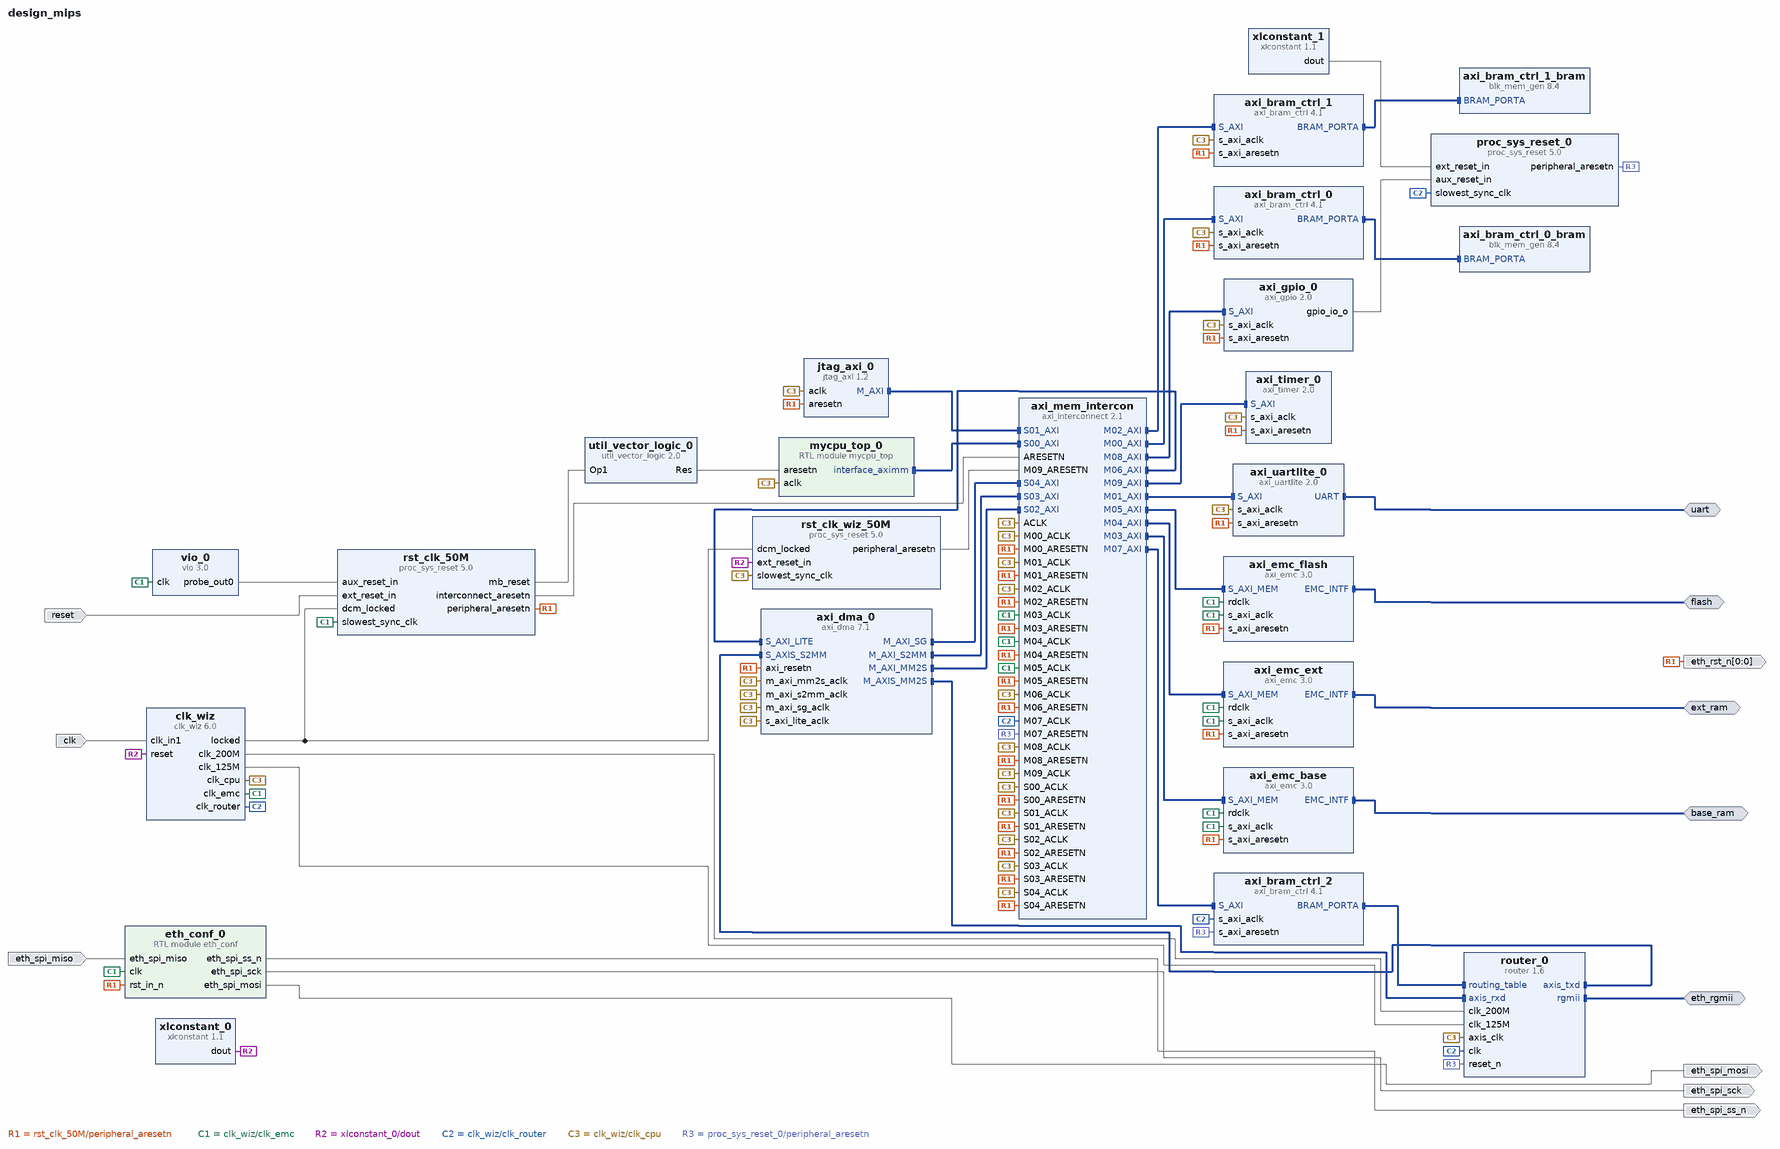
[diagram p0: block diagram of the top level]
# Vivado block design design_mips, xc7a100tfgg676-2L, Vivado 2018.3
create_bd_design design_mips

create_bd_intf_port -mode Master -vlnv xilinx.com:interface:uart_rtl:1.0 uart
create_bd_intf_port -mode Master -vlnv xilinx.com:interface:emc_rtl:1.0 base_ram
create_bd_intf_port -mode Master -vlnv xilinx.com:interface:emc_rtl:1.0 ext_ram
create_bd_intf_port -mode Master -vlnv xilinx.com:interface:emc_rtl:1.0 flash
create_bd_intf_port -mode Master -vlnv xilinx.com:interface:rgmii_rtl:1.0 eth_rgmii
create_bd_port -dir I -type clk clk
set_property -dict {CONFIG.FREQ_HZ 50000000} [get_bd_ports clk]
create_bd_port -dir I -type rst reset
set_property -dict {CONFIG.POLARITY ACTIVE_HIGH} [get_bd_ports reset]
create_bd_port -dir O -from 0 -to 0 -type rst eth_rst_n
set_property -dict {CONFIG.POLARITY ACTIVE_LOW} [get_bd_ports eth_rst_n]
create_bd_port -dir O eth_spi_ss_n
create_bd_port -dir O eth_spi_sck
create_bd_port -dir I eth_spi_miso
create_bd_port -dir O eth_spi_mosi

create_bd_cell -type module -reference mycpu_top mycpu_top_0
create_bd_cell -type ip -vlnv xilinx.com:ip:axi_bram_ctrl:4.1 axi_bram_ctrl_0
set_property -dict {CONFIG.SINGLE_PORT_BRAM 1} [get_bd_cells axi_bram_ctrl_0]
create_bd_cell -type ip -vlnv xilinx.com:ip:proc_sys_reset:5.0 rst_clk_50M
create_bd_cell -type ip -vlnv xilinx.com:ip:blk_mem_gen:8.4 axi_bram_ctrl_0_bram
set_property -dict [list \
  CONFIG.Coe_File ../../../../../../GuGuMIPS/boot/bootloader.coe \
  CONFIG.Load_Init_File true \
  CONFIG.Memory_Type Single_Port_ROM \
  CONFIG.Port_A_Write_Rate 0 \
] [get_bd_cells axi_bram_ctrl_0_bram]
create_bd_cell -type ip -vlnv xilinx.com:ip:axi_interconnect:2.1 axi_mem_intercon
set_property -dict {CONFIG.NUM_MI 10 CONFIG.NUM_SI 5 CONFIG.STRATEGY 1} [get_bd_cells axi_mem_intercon]
create_bd_cell -type ip -vlnv xilinx.com:ip:axi_uartlite:2.0 axi_uartlite_0
set_property -dict {CONFIG.C_BAUDRATE 115200} [get_bd_cells axi_uartlite_0]
create_bd_cell -type ip -vlnv xilinx.com:ip:util_vector_logic:2.0 util_vector_logic_0
set_property -dict {CONFIG.C_OPERATION not} [get_bd_cells util_vector_logic_0]
create_bd_cell -type ip -vlnv xilinx.com:ip:axi_bram_ctrl:4.1 axi_bram_ctrl_1
set_property -dict {CONFIG.SINGLE_PORT_BRAM 1} [get_bd_cells axi_bram_ctrl_1]
create_bd_cell -type ip -vlnv xilinx.com:ip:blk_mem_gen:8.4 axi_bram_ctrl_1_bram
set_property -dict {CONFIG.Memory_Type Single_Port_RAM CONFIG.Port_A_Write_Rate 50} [get_bd_cells axi_bram_ctrl_1_bram]
create_bd_cell -type ip -vlnv xilinx.com:ip:jtag_axi:1.2 jtag_axi_0
create_bd_cell -type ip -vlnv xilinx.com:ip:axi_emc:3.0 axi_emc_base
set_property -dict [list \
  CONFIG.C_INCLUDE_DATAWIDTH_MATCHING_0 0 \
  CONFIG.C_MAX_MEM_WIDTH 32 \
  CONFIG.C_MEM0_TYPE 1 \
  CONFIG.C_MEM0_WIDTH 32 \
  CONFIG.C_NUM_BANKS_MEM 1 \
  CONFIG.C_S_AXI_EN_REG 0 \
  CONFIG.C_TLZWE_PS_MEM_0 0 \
  CONFIG.C_TWC_PS_MEM_0 15000 \
  CONFIG.C_TWP_PS_MEM_0 12000 \
] [get_bd_cells axi_emc_base]
create_bd_cell -type ip -vlnv xilinx.com:ip:clk_wiz:6.0 clk_wiz
set_property -dict [list \
  CONFIG.CLKOUT1_JITTER 204.383 \
  CONFIG.CLKOUT1_REQUESTED_OUT_FREQ 40.000 \
  CONFIG.CLKOUT2_JITTER 285.743 \
  CONFIG.CLKOUT2_PHASE_ERROR 164.985 \
  CONFIG.CLKOUT2_REQUESTED_OUT_FREQ 10.000 \
  CONFIG.CLKOUT2_USED true \
  CONFIG.CLKOUT3_REQUESTED_OUT_FREQ 200 \
  CONFIG.CLKOUT3_USED true \
  CONFIG.CLKOUT4_REQUESTED_OUT_FREQ 125 \
  CONFIG.CLKOUT4_USED true \
  CONFIG.CLKOUT5_JITTER 172.249 \
  CONFIG.CLKOUT5_PHASE_ERROR 164.985 \
  CONFIG.CLKOUT5_REQUESTED_OUT_FREQ 80.000 \
  CONFIG.CLKOUT5_USED true \
  CONFIG.CLK_OUT1_PORT clk_cpu \
  CONFIG.CLK_OUT2_PORT clk_emc \
  CONFIG.CLK_OUT3_PORT clk_200M \
  CONFIG.CLK_OUT4_PORT clk_125M \
  CONFIG.CLK_OUT5_PORT clk_router \
  CONFIG.MMCM_CLKOUT0_DIVIDE_F 25.000 \
  CONFIG.MMCM_CLKOUT1_DIVIDE 100 \
  CONFIG.MMCM_CLKOUT4_DIVIDE 13 \
  CONFIG.MMCM_DIVCLK_DIVIDE 1 \
  CONFIG.NUM_OUT_CLKS 5 \
] [get_bd_cells clk_wiz]
create_bd_cell -type ip -vlnv xilinx.com:ip:xlconstant:1.1 xlconstant_0
set_property -dict {CONFIG.CONST_VAL 0} [get_bd_cells xlconstant_0]
create_bd_cell -type ip -vlnv xilinx.com:ip:axi_emc:3.0 axi_emc_ext
set_property -dict [list \
  CONFIG.C_INCLUDE_DATAWIDTH_MATCHING_0 0 \
  CONFIG.C_MAX_MEM_WIDTH 32 \
  CONFIG.C_MEM0_TYPE 1 \
  CONFIG.C_MEM0_WIDTH 32 \
] [get_bd_cells axi_emc_ext]
create_bd_cell -type ip -vlnv xilinx.com:ip:axi_emc:3.0 axi_emc_flash
set_property -dict [list \
  CONFIG.C_INCLUDE_DATAWIDTH_MATCHING_0 1 \
  CONFIG.C_MAX_MEM_WIDTH 16 \
  CONFIG.C_MEM0_TYPE 5 \
  CONFIG.C_MEM0_WIDTH 16 \
] [get_bd_cells axi_emc_flash]
create_bd_cell -type ip -vlnv xilinx.com:ip:vio:3.0 vio_0
set_property -dict {CONFIG.C_NUM_PROBE_IN 0 CONFIG.C_PROBE_OUT0_INIT_VAL 0x1} [get_bd_cells vio_0]
create_bd_cell -type ip -vlnv xilinx.com:ip:axi_dma:7.1 axi_dma_0
set_property -dict [list \
  CONFIG.c_include_sg 1 \
  CONFIG.c_m_axis_mm2s_tdata_width 8 \
  CONFIG.c_sg_include_stscntrl_strm 0 \
] [get_bd_cells axi_dma_0]
create_bd_cell -type ip -vlnv xilinx.com:ip:axi_bram_ctrl:4.1 axi_bram_ctrl_2
set_property -dict {CONFIG.DATA_WIDTH 128 CONFIG.SINGLE_PORT_BRAM 1} [get_bd_cells axi_bram_ctrl_2]
create_bd_cell -type ip -vlnv xilinx.com:ip:axi_gpio:2.0 axi_gpio_0
set_property -dict {CONFIG.C_ALL_OUTPUTS 1 CONFIG.C_GPIO_WIDTH 1} [get_bd_cells axi_gpio_0]
create_bd_cell -type ip -vlnv xilinx.com:ip:axi_timer:2.0 axi_timer_0
set_property -dict {CONFIG.mode_64bit 1} [get_bd_cells axi_timer_0]
create_bd_cell -type ip -vlnv xilinx.com:ip:proc_sys_reset:5.0 rst_clk_wiz_50M
create_bd_cell -type module -reference eth_conf eth_conf_0
create_bd_cell -type ip -vlnv xilinx.com:ip:proc_sys_reset:5.0 proc_sys_reset_0
set_property -dict {CONFIG.C_AUX_RESET_HIGH 0} [get_bd_cells proc_sys_reset_0]
create_bd_cell -type ip -vlnv xilinx.com:ip:xlconstant:1.1 xlconstant_1
create_bd_cell -type ip -vlnv me.jiegec:ip:router:1.6 router_0

# ---- connections ----

connect_bd_intf_net [get_bd_intf_pins axi_mem_intercon/M09_AXI] [get_bd_intf_pins axi_timer_0/S_AXI]
connect_bd_intf_net [get_bd_intf_pins axi_dma_0/M_AXI_SG] [get_bd_intf_pins axi_mem_intercon/S04_AXI]
connect_bd_intf_net [get_bd_intf_pins axi_mem_intercon/M08_AXI] [get_bd_intf_pins axi_gpio_0/S_AXI]
connect_bd_intf_net [get_bd_intf_pins axi_dma_0/M_AXIS_MM2S] [get_bd_intf_pins router_0/axis_rxd]
connect_bd_intf_net [get_bd_intf_ports eth_rgmii] [get_bd_intf_pins router_0/rgmii]
connect_bd_intf_net [get_bd_intf_ports base_ram] [get_bd_intf_pins axi_emc_base/EMC_INTF]
connect_bd_intf_net -intf_net mycpu_top_0_interface_aximm [get_bd_intf_pins mycpu_top_0/interface_aximm] [get_bd_intf_pins axi_mem_intercon/S00_AXI]
connect_bd_intf_net [get_bd_intf_pins axi_mem_intercon/M02_AXI] [get_bd_intf_pins axi_bram_ctrl_1/S_AXI]
connect_bd_intf_net [get_bd_intf_pins axi_bram_ctrl_1_bram/BRAM_PORTA] [get_bd_intf_pins axi_bram_ctrl_1/BRAM_PORTA]
connect_bd_intf_net -intf_net axi_emc_0_EMC_INTF [get_bd_intf_ports flash] [get_bd_intf_pins axi_emc_flash/EMC_INTF]
connect_bd_intf_net [get_bd_intf_pins axi_mem_intercon/M03_AXI] [get_bd_intf_pins axi_emc_base/S_AXI_MEM]
connect_bd_intf_net [get_bd_intf_ports ext_ram] [get_bd_intf_pins axi_emc_ext/EMC_INTF]
connect_bd_intf_net [get_bd_intf_ports uart] [get_bd_intf_pins axi_uartlite_0/UART]
connect_bd_intf_net [get_bd_intf_pins jtag_axi_0/M_AXI] [get_bd_intf_pins axi_mem_intercon/S01_AXI]
connect_bd_intf_net [get_bd_intf_pins axi_bram_ctrl_0_bram/BRAM_PORTA] [get_bd_intf_pins axi_bram_ctrl_0/BRAM_PORTA]
connect_bd_intf_net [get_bd_intf_pins axi_dma_0/M_AXI_S2MM] [get_bd_intf_pins axi_mem_intercon/S03_AXI]
connect_bd_intf_net [get_bd_intf_pins axi_mem_intercon/M01_AXI] [get_bd_intf_pins axi_uartlite_0/S_AXI]
connect_bd_intf_net [get_bd_intf_pins axi_mem_intercon/M04_AXI] [get_bd_intf_pins axi_emc_ext/S_AXI_MEM]
connect_bd_intf_net [get_bd_intf_pins axi_mem_intercon/M00_AXI] [get_bd_intf_pins axi_bram_ctrl_0/S_AXI]
connect_bd_intf_net [get_bd_intf_pins axi_mem_intercon/M05_AXI] [get_bd_intf_pins axi_emc_flash/S_AXI_MEM]
connect_bd_intf_net [get_bd_intf_pins axi_mem_intercon/M06_AXI] [get_bd_intf_pins axi_dma_0/S_AXI_LITE]
connect_bd_intf_net [get_bd_intf_pins axi_mem_intercon/M07_AXI] [get_bd_intf_pins axi_bram_ctrl_2/S_AXI]
connect_bd_intf_net [get_bd_intf_pins axi_dma_0/S_AXIS_S2MM] [get_bd_intf_pins router_0/axis_txd]
connect_bd_intf_net [get_bd_intf_pins axi_dma_0/M_AXI_MM2S] [get_bd_intf_pins axi_mem_intercon/S02_AXI]
connect_bd_intf_net [get_bd_intf_pins axi_bram_ctrl_2/BRAM_PORTA] [get_bd_intf_pins router_0/routing_table]
connect_bd_net [get_bd_pins rst_clk_50M/peripheral_aresetn] \
  [get_bd_pins axi_bram_ctrl_0/s_axi_aresetn] [get_bd_pins axi_mem_intercon/S00_ARESETN] \
  [get_bd_pins axi_mem_intercon/M00_ARESETN] [get_bd_pins axi_uartlite_0/s_axi_aresetn] \
  [get_bd_pins axi_mem_intercon/M01_ARESETN] [get_bd_pins axi_bram_ctrl_1/s_axi_aresetn] \
  [get_bd_pins axi_mem_intercon/M02_ARESETN] [get_bd_pins jtag_axi_0/aresetn] [get_bd_pins axi_mem_intercon/S01_ARESETN] \
  [get_bd_pins axi_emc_base/s_axi_aresetn] [get_bd_pins axi_mem_intercon/M03_ARESETN] [get_bd_pins axi_emc_ext/s_axi_aresetn] \
  [get_bd_pins axi_mem_intercon/M04_ARESETN] [get_bd_pins axi_emc_flash/s_axi_aresetn] \
  [get_bd_pins axi_mem_intercon/M05_ARESETN] [get_bd_pins axi_mem_intercon/M06_ARESETN] \
  [get_bd_pins axi_mem_intercon/S02_ARESETN] [get_bd_pins axi_mem_intercon/S03_ARESETN] [get_bd_pins axi_dma_0/axi_resetn] \
  [get_bd_ports eth_rst_n] [get_bd_pins axi_mem_intercon/S04_ARESETN] [get_bd_pins axi_gpio_0/s_axi_aresetn] \
  [get_bd_pins axi_mem_intercon/M08_ARESETN] [get_bd_pins axi_timer_0/s_axi_aresetn] [get_bd_pins eth_conf_0/rst_in_n]
connect_bd_net [get_bd_ports reset] [get_bd_pins rst_clk_50M/ext_reset_in]
connect_bd_net [get_bd_pins rst_clk_50M/interconnect_aresetn] [get_bd_pins axi_mem_intercon/ARESETN]
connect_bd_net [get_bd_pins rst_clk_50M/mb_reset] [get_bd_pins util_vector_logic_0/Op1]
connect_bd_net [get_bd_pins util_vector_logic_0/Res] [get_bd_pins mycpu_top_0/aresetn]
connect_bd_net -net clk_wiz_clk_out2 [get_bd_pins clk_wiz/clk_emc] \
  [get_bd_pins axi_emc_base/rdclk] [get_bd_pins axi_emc_base/s_axi_aclk] [get_bd_pins axi_mem_intercon/M03_ACLK] \
  [get_bd_pins rst_clk_50M/slowest_sync_clk] [get_bd_pins axi_emc_ext/s_axi_aclk] [get_bd_pins axi_mem_intercon/M04_ACLK] \
  [get_bd_pins axi_emc_ext/rdclk] [get_bd_pins axi_emc_flash/s_axi_aclk] [get_bd_pins axi_mem_intercon/M05_ACLK] \
  [get_bd_pins axi_emc_flash/rdclk] [get_bd_pins vio_0/clk] [get_bd_pins eth_conf_0/clk]
connect_bd_net [get_bd_pins clk_wiz/locked] [get_bd_pins rst_clk_50M/dcm_locked] [get_bd_pins rst_clk_wiz_50M/dcm_locked]
connect_bd_net [get_bd_ports clk] [get_bd_pins clk_wiz/clk_in1]
connect_bd_net [get_bd_pins xlconstant_0/dout] [get_bd_pins clk_wiz/reset] [get_bd_pins rst_clk_wiz_50M/ext_reset_in]
connect_bd_net [get_bd_pins eth_conf_0/eth_spi_ss_n] [get_bd_ports eth_spi_ss_n]
connect_bd_net [get_bd_pins eth_conf_0/eth_spi_sck] [get_bd_ports eth_spi_sck]
connect_bd_net -net eth_spi_miso_0_1 [get_bd_ports eth_spi_miso] [get_bd_pins eth_conf_0/eth_spi_miso]
connect_bd_net [get_bd_pins eth_conf_0/eth_spi_mosi] [get_bd_ports eth_spi_mosi]
connect_bd_net [get_bd_pins vio_0/probe_out0] [get_bd_pins rst_clk_50M/aux_reset_in]
connect_bd_net [get_bd_pins clk_wiz/clk_200M] [get_bd_pins router_0/clk_200M]
connect_bd_net [get_bd_pins clk_wiz/clk_125M] [get_bd_pins router_0/clk_125M]
connect_bd_net [get_bd_pins clk_wiz/clk_router] \
  [get_bd_pins proc_sys_reset_0/slowest_sync_clk] [get_bd_pins axi_bram_ctrl_2/s_axi_aclk] \
  [get_bd_pins axi_mem_intercon/M07_ACLK] [get_bd_pins router_0/clk]
connect_bd_net [get_bd_pins clk_wiz/clk_cpu] \
  [get_bd_pins mycpu_top_0/aclk] [get_bd_pins axi_bram_ctrl_0/s_axi_aclk] [get_bd_pins axi_mem_intercon/ACLK] \
  [get_bd_pins axi_mem_intercon/S00_ACLK] [get_bd_pins axi_mem_intercon/M00_ACLK] [get_bd_pins axi_uartlite_0/s_axi_aclk] \
  [get_bd_pins axi_mem_intercon/M01_ACLK] [get_bd_pins axi_bram_ctrl_1/s_axi_aclk] [get_bd_pins axi_mem_intercon/M02_ACLK] \
  [get_bd_pins jtag_axi_0/aclk] [get_bd_pins axi_mem_intercon/S01_ACLK] [get_bd_pins axi_mem_intercon/M06_ACLK] \
  [get_bd_pins axi_mem_intercon/S02_ACLK] [get_bd_pins axi_mem_intercon/S03_ACLK] [get_bd_pins axi_dma_0/m_axi_mm2s_aclk] \
  [get_bd_pins axi_dma_0/s_axi_lite_aclk] [get_bd_pins axi_dma_0/m_axi_s2mm_aclk] [get_bd_pins axi_dma_0/m_axi_sg_aclk] \
  [get_bd_pins axi_mem_intercon/S04_ACLK] [get_bd_pins axi_gpio_0/s_axi_aclk] [get_bd_pins axi_mem_intercon/M08_ACLK] \
  [get_bd_pins axi_timer_0/s_axi_aclk] [get_bd_pins axi_mem_intercon/M09_ACLK] [get_bd_pins rst_clk_wiz_50M/slowest_sync_clk] \
  [get_bd_pins router_0/axis_clk]
connect_bd_net [get_bd_pins rst_clk_wiz_50M/peripheral_aresetn] [get_bd_pins axi_mem_intercon/M09_ARESETN]
connect_bd_net [get_bd_pins proc_sys_reset_0/peripheral_aresetn] \
  [get_bd_pins axi_bram_ctrl_2/s_axi_aresetn] [get_bd_pins axi_mem_intercon/M07_ARESETN] [get_bd_pins router_0/reset_n]
connect_bd_net [get_bd_pins axi_gpio_0/gpio_io_o] [get_bd_pins proc_sys_reset_0/aux_reset_in]
connect_bd_net [get_bd_pins xlconstant_1/dout] [get_bd_pins proc_sys_reset_0/ext_reset_in]
set_property HDL_ATTRIBUTE.DEBUG true [get_bd_intf_nets mycpu_top_0_interface_aximm]
set_property HDL_ATTRIBUTE.MARK_DEBUG true [get_bd_intf_nets mycpu_top_0_interface_aximm]

# ---- address map ----
assign_bd_address -offset 0x00000000 -range 4M -target_address_space [get_bd_addr_spaces axi_dma_0/Data_MM2S] [get_bd_addr_segs axi_emc_base/S_AXI_MEM/Mem0]
assign_bd_address -offset 0x00400000 -range 4M -target_address_space [get_bd_addr_spaces axi_dma_0/Data_MM2S] [get_bd_addr_segs axi_emc_ext/S_AXI_MEM/Mem0]
assign_bd_address -offset 0x00800000 -range 8M -target_address_space [get_bd_addr_spaces axi_dma_0/Data_MM2S] [get_bd_addr_segs axi_emc_flash/S_AXI_MEM/Mem0]
assign_bd_address -offset 0x07FFE000 -range 8K -target_address_space [get_bd_addr_spaces axi_dma_0/Data_MM2S] [get_bd_addr_segs axi_bram_ctrl_1/S_AXI/Mem0]
assign_bd_address -offset 0x1FB00000 -range 128K -target_address_space [get_bd_addr_spaces axi_dma_0/Data_MM2S] [get_bd_addr_segs axi_bram_ctrl_2/S_AXI/Mem0]
assign_bd_address -offset 0x1FC00000 -range 8K -target_address_space [get_bd_addr_spaces axi_dma_0/Data_MM2S] [get_bd_addr_segs axi_bram_ctrl_0/S_AXI/Mem0]
exclude_bd_addr_seg -offset 0x1F900000 -range 64K -target_address_space [get_bd_addr_spaces axi_dma_0/Data_MM2S] [get_bd_addr_segs axi_timer_0/S_AXI/Reg]
exclude_bd_addr_seg -offset 0x1FA00000 -range 64K -target_address_space [get_bd_addr_spaces axi_dma_0/Data_MM2S] [get_bd_addr_segs axi_gpio_0/S_AXI/Reg]
assign_bd_address -offset 0x00000000 -range 4M -target_address_space [get_bd_addr_spaces axi_dma_0/Data_S2MM] [get_bd_addr_segs axi_emc_base/S_AXI_MEM/Mem0]
assign_bd_address -offset 0x00400000 -range 4M -target_address_space [get_bd_addr_spaces axi_dma_0/Data_S2MM] [get_bd_addr_segs axi_emc_ext/S_AXI_MEM/Mem0]
assign_bd_address -offset 0x00800000 -range 8M -target_address_space [get_bd_addr_spaces axi_dma_0/Data_S2MM] [get_bd_addr_segs axi_emc_flash/S_AXI_MEM/Mem0]
assign_bd_address -offset 0x07FFE000 -range 8K -target_address_space [get_bd_addr_spaces axi_dma_0/Data_S2MM] [get_bd_addr_segs axi_bram_ctrl_1/S_AXI/Mem0]
assign_bd_address -offset 0x1FB00000 -range 128K -target_address_space [get_bd_addr_spaces axi_dma_0/Data_S2MM] [get_bd_addr_segs axi_bram_ctrl_2/S_AXI/Mem0]
assign_bd_address -offset 0x1FC00000 -range 8K -target_address_space [get_bd_addr_spaces axi_dma_0/Data_S2MM] [get_bd_addr_segs axi_bram_ctrl_0/S_AXI/Mem0]
exclude_bd_addr_seg -offset 0x1F900000 -range 64K -target_address_space [get_bd_addr_spaces axi_dma_0/Data_S2MM] [get_bd_addr_segs axi_timer_0/S_AXI/Reg]
exclude_bd_addr_seg -offset 0x1FA00000 -range 64K -target_address_space [get_bd_addr_spaces axi_dma_0/Data_S2MM] [get_bd_addr_segs axi_gpio_0/S_AXI/Reg]
assign_bd_address -offset 0x00000000 -range 4M -target_address_space [get_bd_addr_spaces axi_dma_0/Data_SG] [get_bd_addr_segs axi_emc_base/S_AXI_MEM/Mem0]
assign_bd_address -offset 0x00400000 -range 4M -target_address_space [get_bd_addr_spaces axi_dma_0/Data_SG] [get_bd_addr_segs axi_emc_ext/S_AXI_MEM/Mem0]
assign_bd_address -offset 0x00800000 -range 8M -target_address_space [get_bd_addr_spaces axi_dma_0/Data_SG] [get_bd_addr_segs axi_emc_flash/S_AXI_MEM/Mem0]
assign_bd_address -offset 0x07FFE000 -range 8K -target_address_space [get_bd_addr_spaces axi_dma_0/Data_SG] [get_bd_addr_segs axi_bram_ctrl_1/S_AXI/Mem0]
assign_bd_address -offset 0x1FB00000 -range 128K -target_address_space [get_bd_addr_spaces axi_dma_0/Data_SG] [get_bd_addr_segs axi_bram_ctrl_2/S_AXI/Mem0]
assign_bd_address -offset 0x1FC00000 -range 8K -target_address_space [get_bd_addr_spaces axi_dma_0/Data_SG] [get_bd_addr_segs axi_bram_ctrl_0/S_AXI/Mem0]
exclude_bd_addr_seg -offset 0x1F900000 -range 64K -target_address_space [get_bd_addr_spaces axi_dma_0/Data_SG] [get_bd_addr_segs axi_timer_0/S_AXI/Reg]
exclude_bd_addr_seg -offset 0x1FA00000 -range 64K -target_address_space [get_bd_addr_spaces axi_dma_0/Data_SG] [get_bd_addr_segs axi_gpio_0/S_AXI/Reg]
exclude_bd_addr_seg -offset 0x1FD00000 -range 64K -target_address_space [get_bd_addr_spaces axi_dma_0/Data_SG] [get_bd_addr_segs axi_uartlite_0/S_AXI/Reg]
exclude_bd_addr_seg -offset 0x1FF00000 -range 64K -target_address_space [get_bd_addr_spaces axi_dma_0/Data_SG] [get_bd_addr_segs axi_dma_0/S_AXI_LITE/Reg]
assign_bd_address -offset 0x00000000 -range 4M -target_address_space [get_bd_addr_spaces jtag_axi_0/Data] [get_bd_addr_segs axi_emc_base/S_AXI_MEM/Mem0]
assign_bd_address -offset 0x00400000 -range 4M -target_address_space [get_bd_addr_spaces jtag_axi_0/Data] [get_bd_addr_segs axi_emc_ext/S_AXI_MEM/Mem0]
assign_bd_address -offset 0x00800000 -range 8M -target_address_space [get_bd_addr_spaces jtag_axi_0/Data] [get_bd_addr_segs axi_emc_flash/S_AXI_MEM/Mem0]
assign_bd_address -offset 0x07FFE000 -range 8K -target_address_space [get_bd_addr_spaces jtag_axi_0/Data] [get_bd_addr_segs axi_bram_ctrl_1/S_AXI/Mem0]
assign_bd_address -offset 0x1F900000 -range 64K -target_address_space [get_bd_addr_spaces jtag_axi_0/Data] [get_bd_addr_segs axi_timer_0/S_AXI/Reg]
assign_bd_address -offset 0x1FA00000 -range 64K -target_address_space [get_bd_addr_spaces jtag_axi_0/Data] [get_bd_addr_segs axi_gpio_0/S_AXI/Reg]
assign_bd_address -offset 0x1FB00000 -range 128K -target_address_space [get_bd_addr_spaces jtag_axi_0/Data] [get_bd_addr_segs axi_bram_ctrl_2/S_AXI/Mem0]
assign_bd_address -offset 0x1FC00000 -range 8K -target_address_space [get_bd_addr_spaces jtag_axi_0/Data] [get_bd_addr_segs axi_bram_ctrl_0/S_AXI/Mem0]
assign_bd_address -offset 0x1FD00000 -range 64K -target_address_space [get_bd_addr_spaces jtag_axi_0/Data] [get_bd_addr_segs axi_uartlite_0/S_AXI/Reg]
assign_bd_address -offset 0x1FF00000 -range 64K -target_address_space [get_bd_addr_spaces jtag_axi_0/Data] [get_bd_addr_segs axi_dma_0/S_AXI_LITE/Reg]
assign_bd_address -offset 0x00000000 -range 4M -target_address_space [get_bd_addr_spaces mycpu_top_0/interface_aximm] [get_bd_addr_segs axi_emc_base/S_AXI_MEM/Mem0]
assign_bd_address -offset 0x00400000 -range 4M -target_address_space [get_bd_addr_spaces mycpu_top_0/interface_aximm] [get_bd_addr_segs axi_emc_ext/S_AXI_MEM/Mem0]
assign_bd_address -offset 0x00800000 -range 8M -target_address_space [get_bd_addr_spaces mycpu_top_0/interface_aximm] [get_bd_addr_segs axi_emc_flash/S_AXI_MEM/Mem0]
assign_bd_address -offset 0x07FFE000 -range 8K -target_address_space [get_bd_addr_spaces mycpu_top_0/interface_aximm] [get_bd_addr_segs axi_bram_ctrl_1/S_AXI/Mem0]
assign_bd_address -offset 0x1F900000 -range 64K -target_address_space [get_bd_addr_spaces mycpu_top_0/interface_aximm] [get_bd_addr_segs axi_timer_0/S_AXI/Reg]
assign_bd_address -offset 0x1FA00000 -range 64K -target_address_space [get_bd_addr_spaces mycpu_top_0/interface_aximm] [get_bd_addr_segs axi_gpio_0/S_AXI/Reg]
assign_bd_address -offset 0x1FB00000 -range 128K -target_address_space [get_bd_addr_spaces mycpu_top_0/interface_aximm] [get_bd_addr_segs axi_bram_ctrl_2/S_AXI/Mem0]
assign_bd_address -offset 0x1FC00000 -range 8K -target_address_space [get_bd_addr_spaces mycpu_top_0/interface_aximm] [get_bd_addr_segs axi_bram_ctrl_0/S_AXI/Mem0]
assign_bd_address -offset 0x1FD00000 -range 64K -target_address_space [get_bd_addr_spaces mycpu_top_0/interface_aximm] [get_bd_addr_segs axi_uartlite_0/S_AXI/Reg]
assign_bd_address -offset 0x1FF00000 -range 64K -target_address_space [get_bd_addr_spaces mycpu_top_0/interface_aximm] [get_bd_addr_segs axi_dma_0/S_AXI_LITE/Reg]

validate_bd_design
save_bd_design
